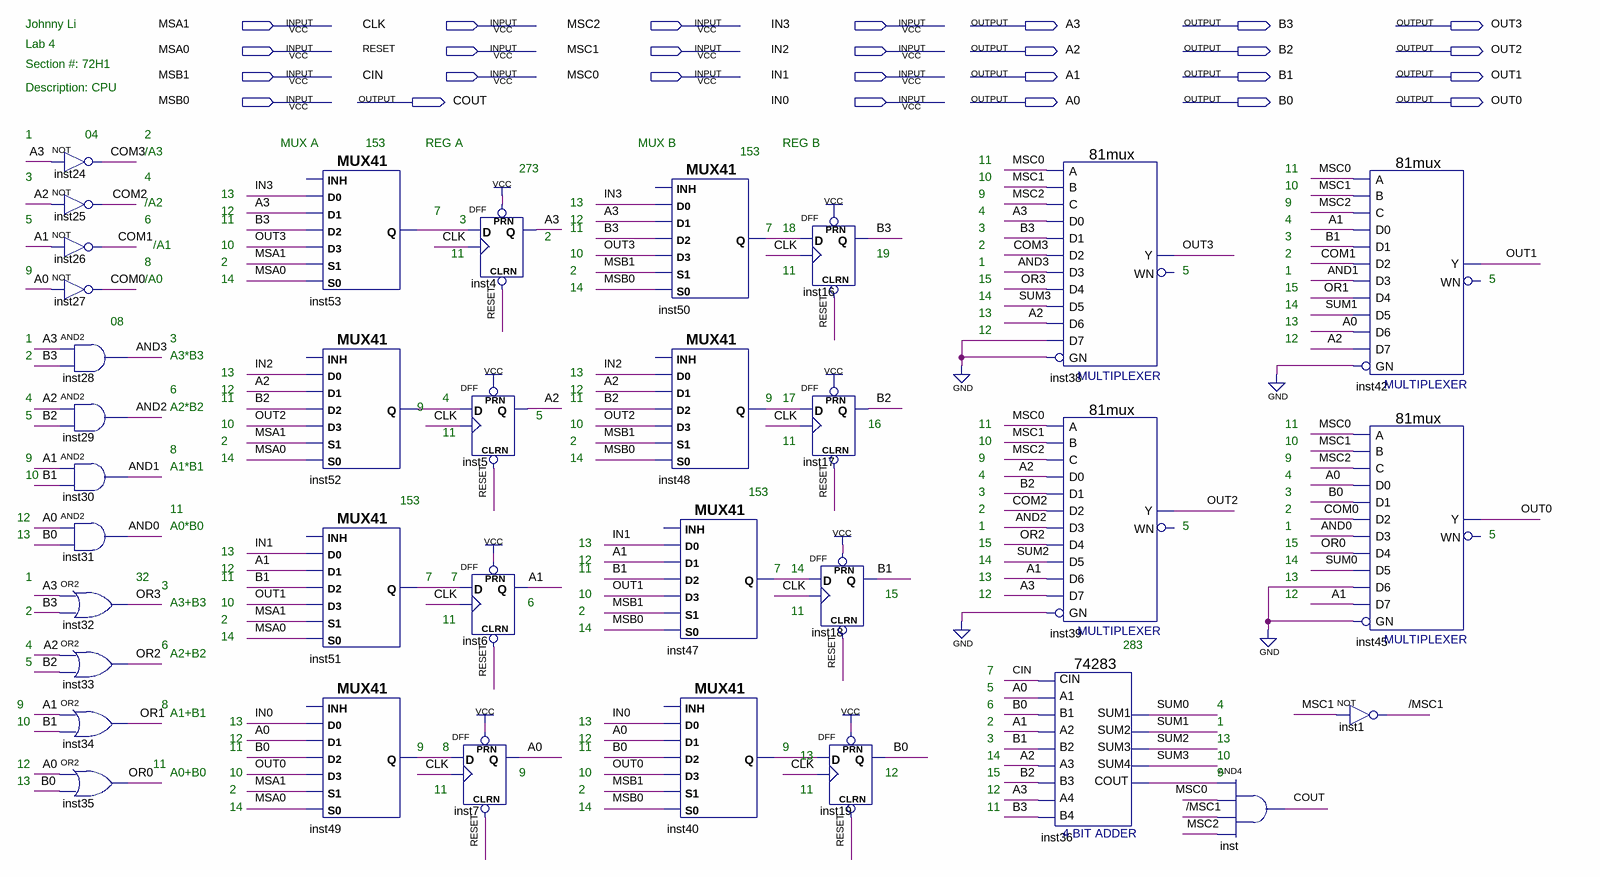
[diagram p0: schematic sheet]
// Quartus schematic Lab4_CPU.bdf as structural Verilog: 35 symbols, 27 pins
module Lab4_CPU (
  input  MSA1,
  input  CLK,
  input  MSC2,
  input  IN3,
  input  MSA0,
  input  RESET,
  input  MSC1,
  input  IN2,
  input  MSB1,
  input  CIN,
  input  MSC0,
  input  IN1,
  input  MSB0,
  input  IN0,
  output A3,
  output B3,
  output OUT3,
  output A2,
  output B2,
  output OUT2,
  output A1,
  output B1,
  output OUT1,
  output COUT,
  output A0,
  output B0,
  output OUT0
);

  wire \/MSC1 , AND0, AND1, AND2, AND3, COM0, COM1, COM2, COM3, inst36_cout, inst40_q, inst47_q, inst48_q,
       inst49_q, inst50_q, inst51_q, inst52_q, inst53_q, OR0, OR1, OR2, OR3, SUM0, SUM1, SUM2, SUM3;

  not inst24 (COM3, A3);
  not inst25 (COM2, A2);
  not inst26 (COM1, A1);
  not inst27 (COM0, A0);
  and inst28 (AND3, A3, B3);
  and inst29 (AND2, A2, B2);
  and inst30 (AND1, A1, B1);
  and inst31 (AND0, A0, B0);
  or inst32 (OR3, A3, B3);
  or inst33 (OR2, A2, B2);
  or inst34 (OR1, A1, B1);
  or inst35 (OR0, A0, B0);
  MUX41 inst53 (.S0(MSA0), .D2(B3), .S1(MSA1), .D3(OUT3), .D0(IN3), .D1(A3), .Q(inst53_q));  // open: INH
  MUX41 inst52 (.S0(MSA0), .D2(B2), .S1(MSA1), .D3(OUT2), .D0(IN2), .D1(A2), .Q(inst52_q));  // open: INH
  MUX41 inst51 (.S0(MSA0), .D2(B1), .S1(MSA1), .D3(OUT1), .D0(IN1), .D1(A1), .Q(inst51_q));  // open: INH
  MUX41 inst49 (.S0(MSA0), .D2(B0), .S1(MSA1), .D3(OUT0), .D0(IN0), .D1(A0), .Q(inst49_q));  // open: INH
  DFF inst5 (.CLRN(RESET), .CLK(CLK), .D(inst52_q), .PRN(1'b1), .Q(A2));
  DFF inst6 (.CLRN(RESET), .CLK(CLK), .D(inst51_q), .PRN(1'b1), .Q(A1));
  DFF inst7 (.CLRN(RESET), .CLK(CLK), .D(inst49_q), .PRN(1'b1), .Q(A0));
  DFF inst4 (.CLRN(RESET), .CLK(CLK), .D(inst53_q), .PRN(1'b1), .Q(A3));
  MUX41 inst50 (.S0(MSB0), .D2(B3), .S1(MSB1), .D3(OUT3), .D0(IN3), .D1(A3), .Q(inst50_q));  // open: INH
  MUX41 inst48 (.S0(MSB0), .D2(B2), .S1(MSB1), .D3(OUT2), .D0(IN2), .D1(A2), .Q(inst48_q));  // open: INH
  MUX41 inst47 (.S0(MSB0), .D2(B1), .S1(MSB1), .D3(OUT1), .D0(IN1), .D1(A1), .Q(inst47_q));  // open: INH
  MUX41 inst40 (.S0(MSB0), .D2(B0), .S1(MSB1), .D3(OUT0), .D0(IN0), .D1(A0), .Q(inst40_q));  // open: INH
  DFF inst16 (.CLRN(RESET), .CLK(CLK), .D(inst50_q), .PRN(1'b1), .Q(B3));
  DFF inst17 (.CLRN(RESET), .CLK(CLK), .D(inst48_q), .PRN(1'b1), .Q(B2));
  DFF inst18 (.CLRN(RESET), .CLK(CLK), .D(inst47_q), .PRN(1'b1), .Q(B1));
  DFF inst19 (.CLRN(RESET), .CLK(CLK), .D(inst40_q), .PRN(1'b1), .Q(B0));
  \81mux  inst38 (
    .C(MSC2), .D1(B3), .D0(A3), .D5(SUM3), .D4(OR3), .D2(COM3), .D3(AND3), .GN(1'b0), .D7(1'b0), .D6(A2),
    .A(MSC0), .B(MSC1), .Y(OUT3));  // open: WN
  \81mux  inst39 (
    .C(MSC2), .D1(B2), .D0(A2), .D5(SUM2), .D4(OR2), .D2(COM2), .D3(AND2), .GN(1'b0), .D7(A3), .D6(A1),
    .A(MSC0), .B(MSC1), .Y(OUT2));  // open: WN
  \74283  inst36 (
    .CIN(CIN), .A1(A0), .A2(A1), .B2(B1), .A3(A2), .A4(A3), .B4(B3), .B1(B0), .B3(B2), .SUM4(SUM3),
    .COUT(inst36_cout), .SUM1(SUM0), .SUM2(SUM1), .SUM3(SUM2));
  and inst (COUT, inst36_cout, MSC0, \/MSC1 , MSC2);
  not inst1 (\/MSC1 , MSC1);
  \81mux  inst42 (
    .C(MSC2), .D1(B1), .D0(A1), .D5(SUM1), .D4(OR1), .D2(COM1), .D3(AND1), .GN(1'b0), .D7(A2), .D6(A0),
    .A(MSC0), .B(MSC1), .Y(OUT1));  // open: WN
  \81mux  inst45 (
    .C(MSC2), .D1(B0), .D0(A0), .D5(SUM0), .D4(OR0), .D2(COM0), .D3(AND0), .GN(1'b0), .D7(A1), .D6(1'b0),
    .A(MSC0), .B(MSC1), .Y(OUT0));  // open: WN

  // Notes on the sheet:
  //   Johnny Li 
  //   Lab 4 
  //   Section #: 72H1
  //   Description: CPU
  //   1
  //   04
  //   2
  //   MUX A
  //   153
  //   REG A
  //   MUX B
  //   REG B
  //   /A3
  //   153
  //   11
  //   273
  //   11
  //   3
  //   4
  //   10
  //   10
  //   13
  //   9
  //   /A2
  //   13
  //   9
  //   12
  //   7
  //   4
  //   5
  //   6
  //   11
  //   3
  //   12
  //   4
  //   11
  //   7
  //   18
  //   3
  //   2
  //   3
  //   /A1
  //   10
  //   2
  //   11
  //   10
  //   19
  //   2
  //   8
  //   2
  //   1
  //   9
  //   2
  //   11
  //   5
  //   1
  //   /A0
  //   14
  //   15
  //   5
  //   14
  //   15
  //   14
  //   14
  //   13
  //   08
  //   13
  //   12
  //   1
  //   3
  //   12
  //   2
  //   A3*B3
  //   13
  //   13
  //   6
  //   12
  //   12
  //   4
  //   11
  //   4
  //   11
  //   9
  //   17
  //   A2*B2
  //   9
  //   5
  //   5
  //   10
  //   10
  //   16
  //   11
  //   11
  //   11
  //   2
  //   2
  //   11
  //   10
  //   10
  //   8
  //   9
  //   14
  //   14
  //   9
  //   9
  //   A1*B1
  //   10
  //   4
  //   4
  //   153
  //   3
  //   3
  //   153
  //   11
  //   2
  //   2
  //   12
  //   A0*B0
  //   1
  //   5
  //   1
  //   13
  //   5
  //   13
  //   15
  //   15
  //   13
  //   12
  //   14
  //   14
  //   12
  //   11
  //   7
  //   14
  //   1
  //   32
  //   11
  //   7
  //   7
  //   13
  //   13
  //   3
  //   10
  //   15
  //   12
  //   12
  //   A3+B3
  //   10
  //   6
  //   2
  //   2
  //   11
  //   2
  //   11
  //   14
  //   14
  //   4
  //   6
  //   283
  //   A2+B2
  //   5
  //   7
  //   5
  //   9
  //   8
  //   6
  //   4
  //   A1+B1
  //   10
  //   13
  //   13
  //   2
  //   1
  //   12
  //   12
  //   3
  //   13
  //   11
  //   9
  //   8
  //   11
  //   9
  //   13
  //   14
  //   10
  //   12
  //   11
  //   A0+B0
  //   10
  //   9
  //   10
  //   12
  //   15
  //   9
  //   13
  //   2
  //   11
  //   2
  //   11
  //   12
  //   14
  //   14
  //   11
endmodule
